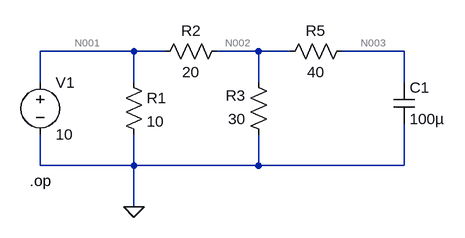
[diagram p0: schematic aula05.asc]
aula05.asc, the LTspice schematic file:
Version 4
SHEET 1 880 680
WIRE -112 208 -256 208
WIRE -64 208 -112 208
WIRE 80 208 16 208
WIRE 128 208 80 208
WIRE 304 208 208 208
WIRE -256 256 -256 208
WIRE -112 256 -112 208
WIRE 80 256 80 208
WIRE 304 256 304 208
WIRE -256 384 -256 336
WIRE -112 384 -112 336
WIRE -112 384 -256 384
WIRE 80 384 80 336
WIRE 80 384 -112 384
WIRE 304 384 304 320
WIRE 304 384 80 384
WIRE -112 448 -112 384
FLAG -112 448 0
SYMBOL voltage -256 240 R0
SYMATTR InstName V1
SYMATTR Value 10
SYMBOL res -128 240 R0
SYMATTR InstName R1
SYMATTR Value 10
SYMBOL res 32 192 R90
WINDOW 0 0 56 VBottom 2
WINDOW 3 32 56 VTop 2
SYMATTR InstName R2
SYMATTR Value 20
SYMBOL res 96 352 R180
WINDOW 0 36 76 Left 2
WINDOW 3 36 40 Left 2
SYMATTR InstName R3
SYMATTR Value 30
SYMBOL res 112 224 R270
WINDOW 0 32 56 VTop 2
WINDOW 3 0 56 VBottom 2
SYMATTR InstName R5
SYMATTR Value 40
SYMBOL cap 288 256 R0
SYMATTR InstName C1
SYMATTR Value 100µ
TEXT -272 408 Left 2 !.op

The netlist it stands for:
* aula05.asc
V1 N001 0 10
R1 N001 0 10
R2 N002 N001 20
R3 0 N002 30
R5 N002 N003 40
C1 N003 0 100µ
.op
.backanno
.end

* Results of the author's LTspice run, read from the files saved beside the schematic
* Operating Point:
*   V(n001) = 10 V
*   V(n002) = 6 V
*   V(n003) = 6 V
*   I(C1) = 0 A
*   I(R5) = 0 A
*   I(R3) = -200 mA
*   I(R2) = -200 mA
*   I(R1) = 1 A
*   I(V1) = -1.2 A